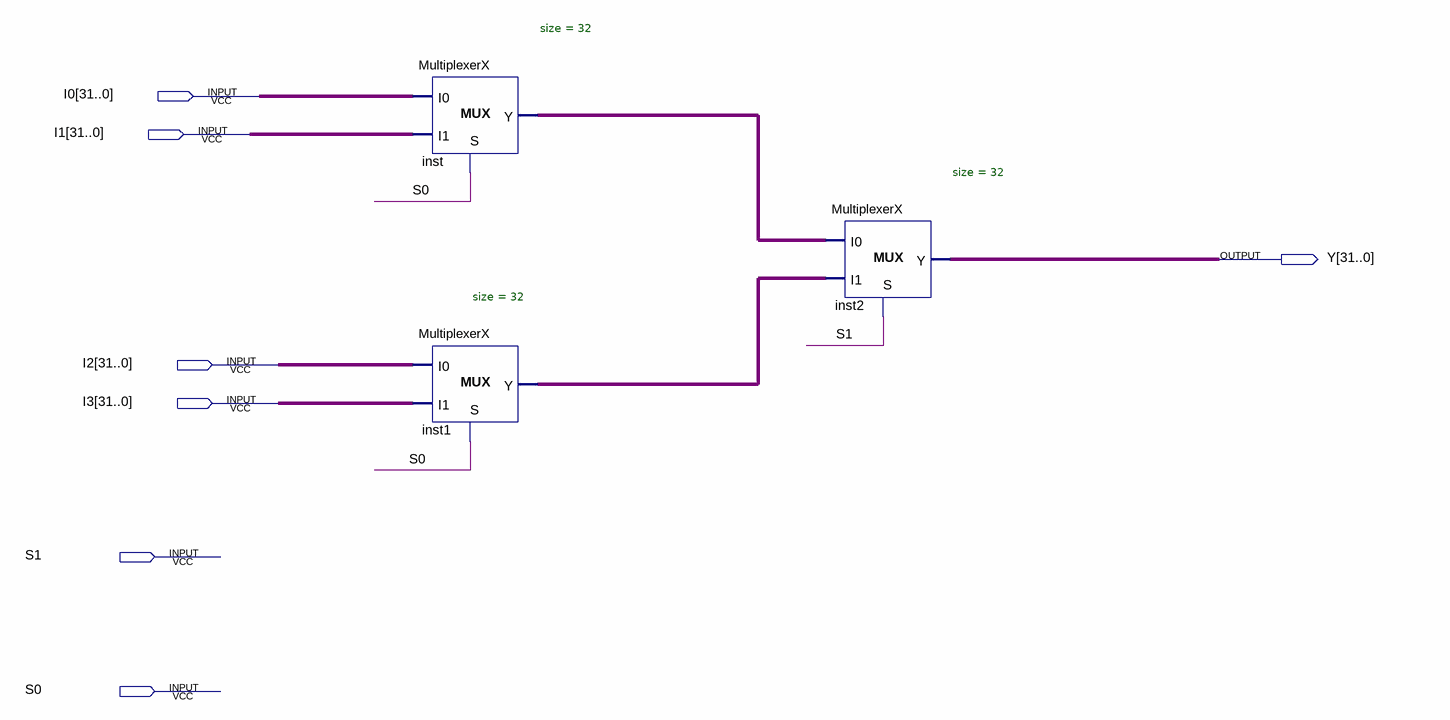
[diagram p0: schematic sheet]
// Quartus schematic MX4.bdf as structural Verilog: 3 symbols, 7 pins
module MX4 (
  input  [31:0] I0,
  input  [31:0] I1,
  input  [31:0] I2,
  input  [31:0] I3,
  input  S1,
  input  S0,
  output [31:0] Y
);

  wire [31:0] inst1_y, inst_y;

  MultiplexerX #(.size(32)) inst (.S(S0), .I0(I0), .I1(I1), .Y(inst_y));
  MultiplexerX #(.size(32)) inst1 (.S(S0), .I0(I2), .I1(I3), .Y(inst1_y));
  MultiplexerX #(.size(32)) inst2 (.S(S1), .I0(inst_y), .I1(inst1_y), .Y(Y));
endmodule
